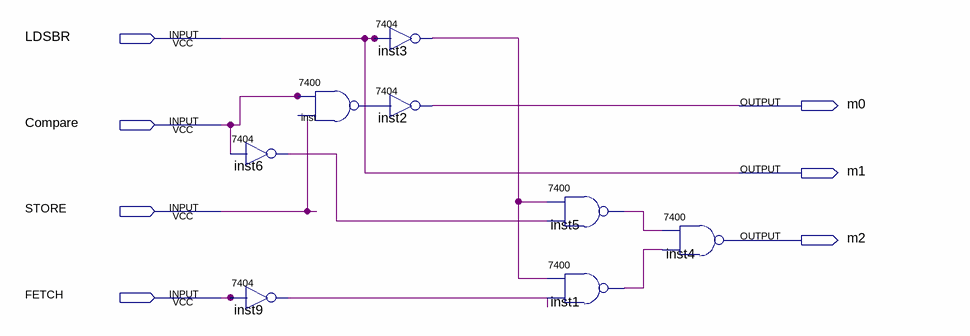
[diagram p0: schematic sheet]
// Quartus schematic ControlLogic.bdf as structural Verilog: 8 symbols, 7 pins
module ControlLogic (
  input  LDSBR,
  input  Compare,
  input  STORE,
  input  FETCH,
  output m0,
  output m1,
  output m2
);

  wire inst1_1, inst3_1, inst5_1, inst6_1, inst9_1, inst_1;

  \7404  inst6 (.\2 (Compare), .\1 (inst6_1));
  \7404  inst9 (.\2 (FETCH), .\1 (inst9_1));
  \7400  inst (.\3 (STORE), .\2 (Compare), .\1 (inst_1));
  \7404  inst3 (.\2 (LDSBR), .\1 (inst3_1));
  \7404  inst2 (.\2 (inst_1), .\1 (m0));
  \7400  inst5 (.\3 (inst6_1), .\2 (inst3_1), .\1 (inst5_1));
  \7400  inst1 (.\3 (inst9_1), .\2 (inst3_1), .\1 (inst1_1));
  \7400  inst4 (.\3 (inst1_1), .\2 (inst5_1), .\1 (m2));

  assign m1 = LDSBR;
endmodule
